# EAGLE design V100_Roco_68826_Fuehrerstand_J2_029_02_02 (EAGLE 5.10)
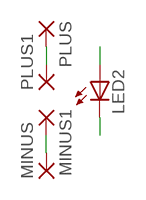
[diagram p0: schematic, sheet 1]

## Parts
LED2  LEDCHIP-LED0603  [CHIP-LED0603]
MINUS  SMD-LONG1,27-1,9  [SMD1,27-1,9]
MINUS1  SMD-LONG1,27-1,9  [SMD1,27-1,9]
PLUS  SMD-LONG1,27-1,9  [SMD1,27-1,9]
PLUS1  SMD-LONG1,27-1,9  [SMD1,27-1,9]

## Nets
MINUS: MINUS1.1(P) MINUS.1(P)
MINUS2: LED2.C
PLUS: PLUS1.1(P) PLUS.1(P)
PLUS2: LED2.A

## Library data of the parts
LED2 = led:LED: LED OSRAM: - CHIPLED LG R971, LG N971, LY N971, LG Q971, LY Q971, LO R971, LY R971 LH N974, LH R974 LS Q976, LO Q976, LY Q976 LO Q996 - Hyper CHIPLED LW Q18S LB Q993, LB Q99A, LB R99A - SideLED LS A670, LO A670, LY A670, LG A670, LP A670 LB A673, LV A673, LT A673, LW A673 LH A674 LY A675 LS A676, LA A676, LO A676, LY A676, LW A676 LS A679, LY A679, LG A679 - Hyper Micro SIDELED® LS Y876, LA Y876, LO Y876, LY Y876 LT Y87S - SmartLED LW L88C, LW L88S LB L89C, LB L89S, LG L890 LS L89K, LO L89K, LY L89K LS L896, LA L896, LO L896, LY L896 - TOPLED LS T670, LO T670, LY T670, LG T670, LP T670 LSG T670, LSP T670, LSY T670, LOP T670, LYG T670 LG T671, LOG T671, LSG T671 LB T673, LV T673, LT T673, LW T673 LH T674 LS T676, LA T676, LO T676, LY T676, LB T676, LH T676, LSB T676, LW T676 LB T67C, LV T67C, LT T67C, LS T67K, LO T67K, LY T67K, LW E67C LS E67B, LA E67B, LO E67B, LY E67B, LB E67C, LV E67C, LT E67C LW T67C LS T679, LY T679, LG T679 LS T770, LO T770, LY T770, LG T770, LP T770 LB T773, LV T773, LT T773, LW T773 LH T774 LS E675, LA E675, LY E675, LS T675 LS T776, LA T776, LO T776, LY T776, LB T776 LHGB T686 LT T68C, LB T68C - Hyper Mini TOPLED® LB M676 - Mini TOPLED Santana® LG M470 LS M47K, LO M47K, LY M47K Source: http://www.osram.convergy.de LUXEON: - LUMILED® LXK2-PW12-R00, LXK2-PW12-S00, LXK2-PW14-U00, LXK2-PW14-V00 LXK2-PM12-R00, LXK2-PM12-S00, LXK2-PM14-U00 LXK2-PE12-Q00, LXK2-PE12-R00, LXK2-PE12-S00, LXK2-PE14-T00, LXK2-PE14-U00 LXK2-PB12-K00, LXK2-PB12-L00, LXK2-PB12-M00, LXK2-PB14-N00, LXK2-PB14-P00, LXK2-PB14-Q00 LXK2-PR12-L00, LXK2-PR12-M00, LXK2-PR14-Q00, LXK2-PR14-R00 LXK2-PD12-Q00, LXK2-PD12-R00, LXK2-PD12-S00 LXK2-PH12-R00, LXK2-PH12-S00 LXK2-PL12-P00, LXK2-PL12-Q00, LXK2-PL12-R00 Source: www.luxeon.com KINGBRIGHT: KA-3528ASYC Source: www.kingbright.com
MINUS MINUS1 PLUS PLUS1 = wirepad:SMD-LONG

## Board
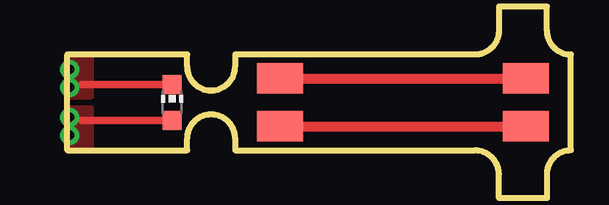
[diagram p1: board, top side]
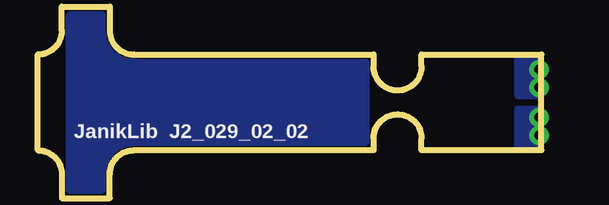
[diagram p2: board, bottom side, seen from below]

No outline drawn. Coordinates in mm, seen from the top.
Copper layers (1*16): Top 0.035mm / dielectric 1.5mm / Bottom 0.035mm
Design rules "default *": minimum track width 7mil, minimum drill 0.4mm, track to track 8mil, track to pad 8mil, pad to pad 8mil, via to via 8mil, smd to smd 8mil, copper to edge 40mil, drill to drill 8mil, minimum pad ring 10mil, minimum via ring 8mil, stop-mask expansion 4mil, vias tented up to drill 0mil, thermal gap 10mil
Milling: 24 lines

### Footprints (pad centres in the part's own frame; a part is rotated, then mirrored left to right if it is on the bottom)
CHIP-LED0603 = smd 0.8 x 0.8: A 0,-0.75; C 0,0.75
SMD1,27-1,9 = smd 1.27 x 1.905: 1 0,0

### Placement (x,y rotation side)
LED2  -2.62,2 0 top
MINUS  12.12,1 90 top
MINUS1  1.88,1 90 top
PLUS  12.12,3 90 top
PLUS1  1.88,3 90 top

### Tracks (layer width: path | path; a pad name or v marks a point on that pad's centre or on a via)
MINUS
  Top 0.406: MINUS1.1 MINUS.1
MINUS2  (via drill 0.4)
  Top 0.305: LED2.C -6.4,2.75
  other vias: -6.9,3.38 -6.9,2.62
  pour Bottom: -6,3.88 -6.88,3.88 -6.88,2.25 -6,2.25
  pour Top: -6,3.88 -6.88,3.88 -6.88,2.25 -6,2.25
N$1
  pour Bottom (isolate 0.254): 12.62,-1.62 12.62,5.62 11.38,5.62 11.38,5 arc-90 10,3.62 0.38,3.62 0.38,0.38 10,0.38 arc-90 11.38,-1 11.38,-1.62
PLUS
  Top 0.406: PLUS1.1 PLUS.1
PLUS2  (via drill 0.4)
  Top 0.305: LED2.A -6.4,1.25
  other vias: -6.9,0.62 -6.9,1.38
  pour Bottom: -6,1.75 -6.88,1.75 -6.88,0.12 -6,0.12
  pour Top: -6,1.75 -6.88,1.75 -6.88,0.12 -6,0.12

### Text on the board
bNames: JanikLib J2_029_02_02
tStop: + | +
bStop: design by Janik Merz
Measures: Dicke = 1,0mm